# EAGLE design LED (EAGLE 8.0.1)
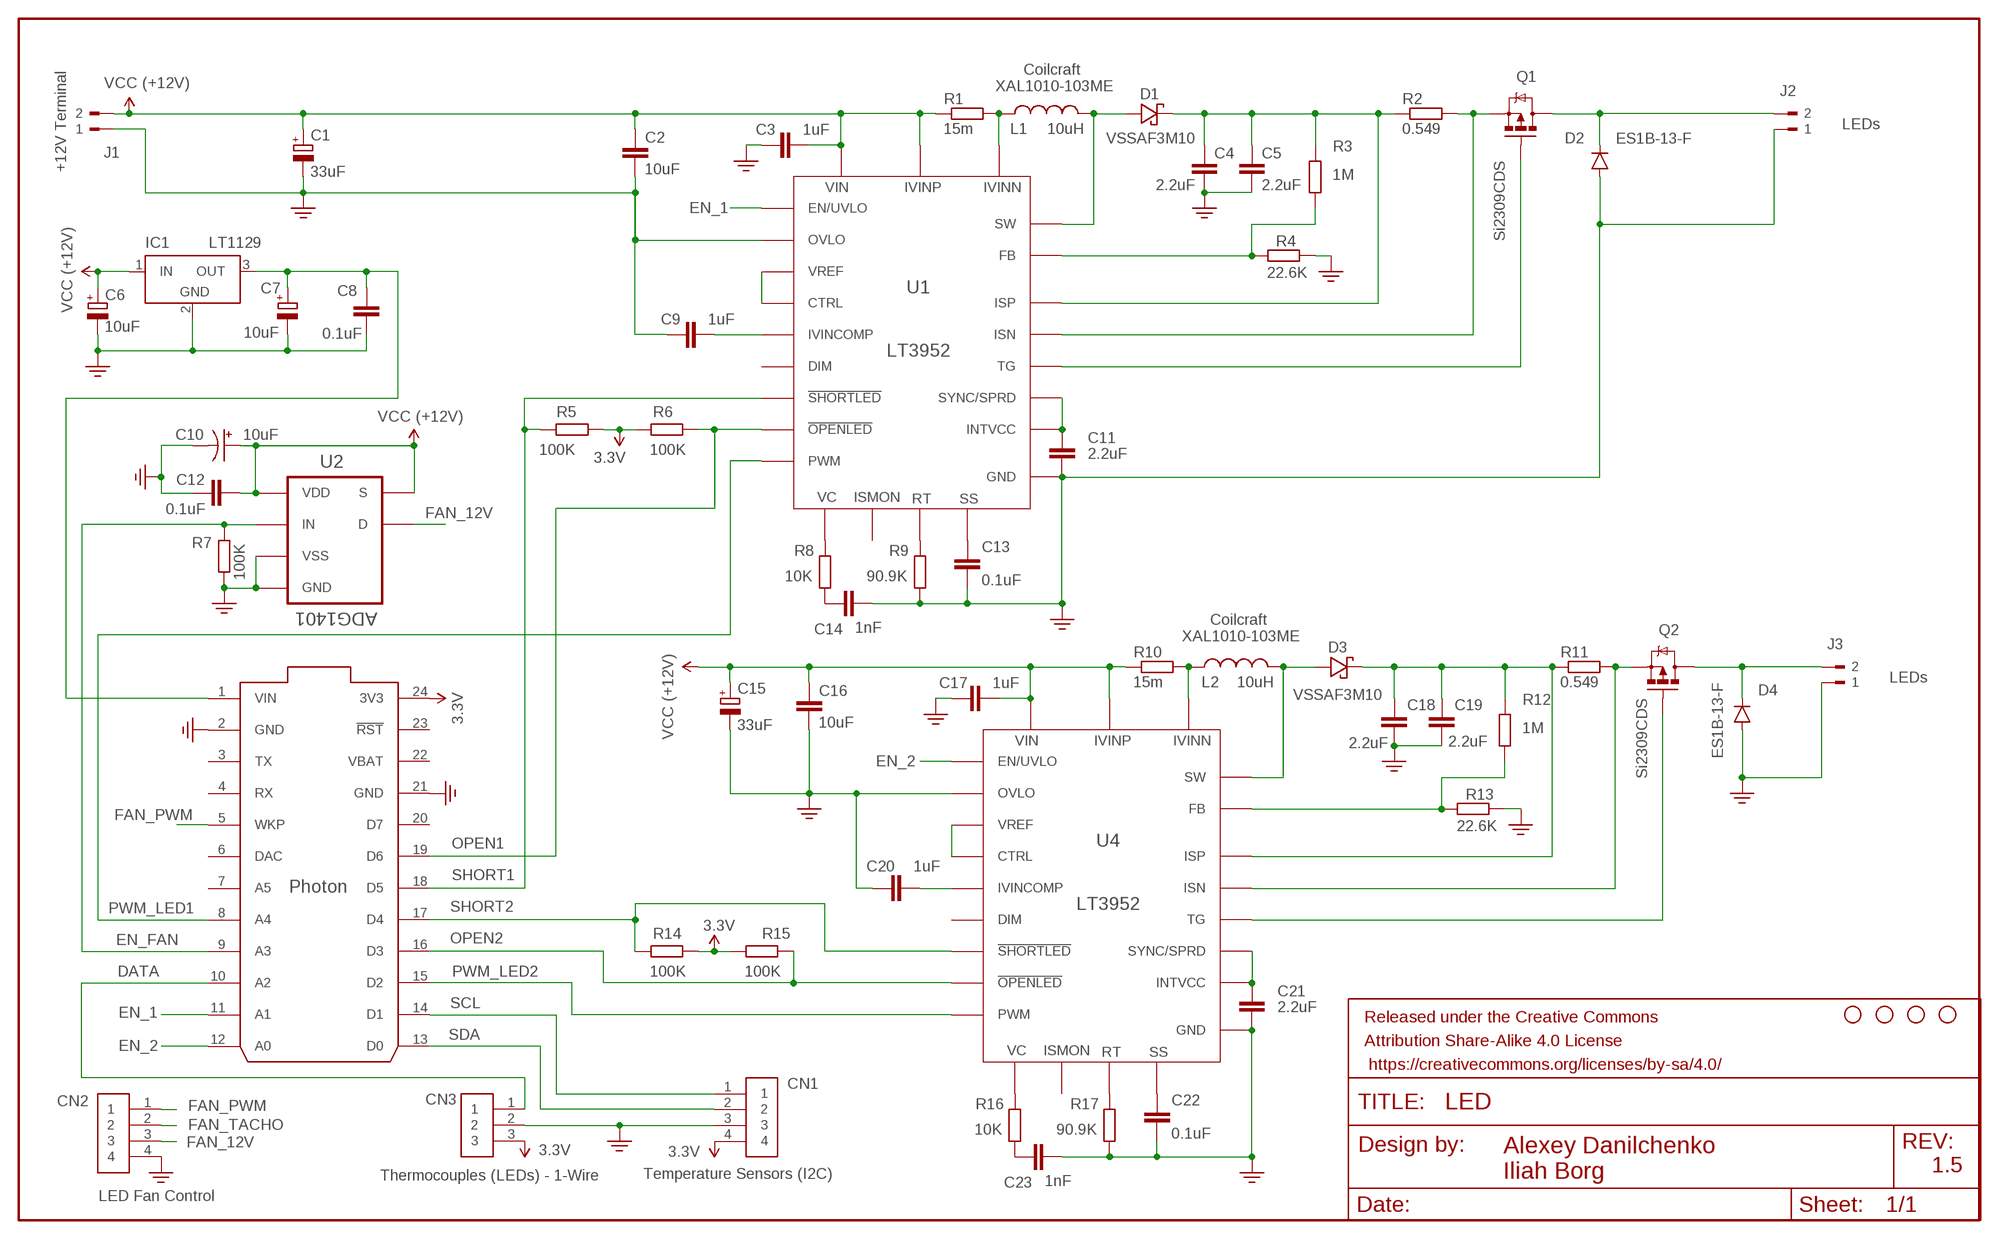
[diagram p0: schematic, sheet 1]

## Parts
C1  33uF  CPOL-EUE  [PANASONIC_E]
C2  10uF  C-EUC1206  [C1206]
C3  1uF  C-EUC0805  [C0805]
C4  2.2uF  C-EUC1206  [C1206]
C5  2.2uF  C-EUC1206  [C1206]
C6  10uF  CPOL-EUCT7343  [CT7343]
C7  10uF  CPOL-EUCT7343  [CT7343]
C8  0.1uF  C-EUC0805  [C0805]
C9  1uF  C-EUC0805  [C0805]
C10  10uF  TANT-CAP1206  [EIA3216]
C11  2.2uF  C-EUC0805  [C0805]
C12  0.1uF  C-EUC0805  [C0805]
C13  0.1uF  C-EUC0805  [C0805]
C14  1nF  C-EUC0805  [C0805]
C15  33uF  CPOL-EUE  [PANASONIC_E]
C16  10uF  C-EUC1206  [C1206]
C17  1uF  C-EUC0805  [C0805]
C18  2.2uF  C-EUC1206  [C1206]
C19  2.2uF  C-EUC1206  [C1206]
C20  1uF  C-EUC0805  [C0805]
C21  2.2uF  C-EUC0805  [C0805]
C22  0.1uF  C-EUC0805  [C0805]
C23  1nF  C-EUC0805  [C0805]
CN1  Temperature Sensors (I2C)  1X4-BIG  [1X04-BIG]
CN2  LED Fan Control  1X4-BIG  [1X04-BIG]
CN3  Thermocouples (LEDs) - 1-Wire  1X03  [1X03]
D1  VSSAF3M10  VSSAF3M10-M3_H  [SODFL5226X100N]
D2  ES1B-13-F  DIODESMA-ALT  [SMA-DIODE_ALT]
D3  VSSAF3M10  VSSAF3M10-M3_H  [SODFL5226X100N]
D4  ES1B-13-F  DIODESMA-ALT  [SMA-DIODE_ALT]
FRAME1  1.0  FRAME-LEDGER  [CREATIVE_COMMONS]
IC1  LT1129  LT1129CST5  [SOT223]
J1  +12V Terminal  PM5.08/2/90BLK  [WEIDMULLER_PM5.08_2]
J2  LEDs  PM5.08/2/90BLK  [WEIDMULLER_PM5.08_2]
J3  LEDs  PM5.08/2/90BLK  [WEIDMULLER_PM5.08_2]
L1  10uH  XAL1010  [XAL1010]
L2  10uH  XAL1010  [XAL1010]
Q1  Si2309CDS  MOSFET-PCHANNEL  [SOT23-3]
Q2  Si2309CDS  MOSFET-PCHANNEL  [SOT23-3]
R1  15m  R-EU_R1206  [R1206]
R2  0.549  R-EU_R1206  [R1206]
R3  1M  R-EU_R0805  [R0805]
R4  22.6K  R-EU_R0805  [R0805]
R5  100K  R-EU_R0805  [R0805]
R6  100K  R-EU_R0805  [R0805]
R7  100K  R-EU_R0805  [R0805]
R8  10K  R-EU_R0805  [R0805]
R9  90.9K  R-EU_R0805  [R0805]
R10  15m  R-EU_R1206  [R1206]
R11  0.549  R-EU_R1206  [R1206]
R12  1M  R-EU_R0805  [R0805]
R13  22.6K  R-EU_R0805  [R0805]
R14  100K  R-EU_R0805  [R0805]
R15  100K  R-EU_R0805  [R0805]
R16  10K  R-EU_R0805  [R0805]
R17  90.9K  R-EU_R0805  [R0805]
STANDOFF1  STAND-OFF  [STAND-OFF]
STANDOFF2  STAND-OFF  [STAND-OFF]
STANDOFF3  STAND-OFF  [STAND-OFF]
STANDOFF4  STAND-OFF  [STAND-OFF]
U1  LT3952  LT3952EFEPBFTSSOP-28_FE/EB-M  [TSSOP-28_FE/EB-M]
U2  ADG1401  ADG1401BRMZ  [SOP65P490X110-8N]
U3  PHOTON_WITH_HEADERS  [PHOTON]
U4  LT3952  LT3952EFEPBFTSSOP-28_FE/EB-M  [TSSOP-28_FE/EB-M]

## Nets
3.3V: CN1.4 CN3.3 R5.1 R6.2 R14.2 R15.1 U3.24(3V3)
+5VDC: C7.+ C8.1 IC1.3(OUT) U3.1(VIN)
DATA: CN3.1 U3.10(A2)
EN_1: U1.8(EN/UVLO) U3.11(A1)
EN_2: U3.12(A0) U4.8(EN/UVLO)
EN_FAN: R7.2 U2.6(IN) U3.9(A3)
FAN_12V: CN2.3 U2.8(D)
FAN_PWM: CN2.1 U3.5(WKP)
FAN_TACHO: CN2.2
GND: C1.- C2.2 C3.2 C4.2 C5.2 C6.- C7.- C8.2 C9.2 C10.C(-) C11.2 C12.1 C13.2 C14.2 C15.- C16.2 C17.2 C18.2 C19.2 C20.2 C21.2 C22.2 C23.2 CN1.3 CN2.4 CN3.2 D2.A D4.A IC1.2(GND) J1.1 J2.1 J3.1 R4.1 R7.1 R9.1 R13.1 R17.1 U1.1(GND) U1.9(OVLO) U1.12(GND) U1.28(GND) U1.EPAD(GND) U2.3(GND) U2.7(VSS) U3.2(GND) U3.21(GND) U4.1(GND) U4.9(OVLO) U4.12(GND) U4.28(GND) U4.EPAD(GND)
N$1: L1.1 R1.2 U1.5(IVINN)
N$2: D1.2(A) L1.2 U1.2(SW) U1.3(SW) U1.4(SW)
N$3: C4.1 C5.1 D1.1(K) R2.1 R3.2 U1.27(ISP)
N$4: R3.1 R4.2 U1.16(FB)
N$5: D2.C J2.2 Q1.3(D)
N$6: Q1.2(S) R2.2 U1.26(ISN)
N$7: Q1.1(G) U1.25(TG)
N$9: C11.1 U1.10(INTVCC) U1.11(SYNC/SPRD)
N$12: U1.17(CTRL) U1.18(VREF)
N$13: C9.1 U1.23(IVINCOMP)
N$14: R9.2 U1.14(RT)
N$15: C13.1 U1.19(SS)
N$16: C14.1 R8.1
N$17: R8.2 U1.13(VC)
N$22: L2.1 R10.2 U4.5(IVINN)
N$23: D3.2(A) L2.2 U4.2(SW) U4.3(SW) U4.4(SW)
N$24: C18.1 C19.1 D3.1(K) R11.1 R12.2 U4.27(ISP)
N$25: D4.C J3.2 Q2.3(D)
N$26: Q2.2(S) R11.2 U4.26(ISN)
N$27: R12.1 R13.2 U4.16(FB)
N$28: Q2.1(G) U4.25(TG)
N$30: C21.1 U4.10(INTVCC) U4.11(SYNC/SPRD)
N$33: U4.17(CTRL) U4.18(VREF)
N$34: C20.1 U4.23(IVINCOMP)
N$35: C22.1 U4.19(SS)
N$36: R17.2 U4.14(RT)
N$37: C23.1 R16.1
N$38: R16.2 U4.13(VC)
OPEN1: R6.1 U1.22(!OPENLED) U3.19(D6)
OPEN2: R15.2 U3.16(D3) U4.22(!OPENLED)
PWM_LED1: U1.20(PWM) U3.8(A4)
PWM_LED2: U3.15(D2) U4.20(PWM)
SCL: CN1.1 U3.14(D1)
SDA: CN1.2 U3.13(D0)
SHORT1: R5.2 U1.21(!SHORTLED) U3.18(D5)
SHORT2: R14.1 U3.17(D4) U4.21(!SHORTLED)
VDD: C1.+ C2.1 C3.1 C6.+ C10.A(+) C12.2 C15.+ C16.1 C17.1 IC1.1(IN) J1.2 R1.1 R10.1 U1.6(IVINP) U1.7(VIN) U2.1(S) U2.4(VDD) U4.6(IVINP) U4.7(VIN) ; supply symbol labelled VCC (+12V)
Unconnected: U1.15(DIM) U1.24(ISMON) U3.3(TX) U3.4(RX) U3.6(DAC) U3.7(A5) U3.20(D7) U3.23(!RST) U4.15(DIM) U4.24(ISMON)

## Notes on the sheet
- Coilcraft 
  XAL1010-103ME
- Coilcraft 
  XAL1010-103ME
- 1.5

## Power pins joined to a net without a drawn wire
GND: IC1.4(GND)
VBAT: U3.22(VBAT)

## Library data of the parts
C1 C15 = resistor:CPOL-EU: POLARIZED CAPACITOR, European symbol
C2 C4 C5 C8 C16 C18 C19 = Spectron2:C-EU: CAPACITOR, European symbol
C3 C9 C11 C13 C14 C17 C20-C23 = rcl:C-EU: CAPACITOR, European symbol
C6 C7 = Spectron:CPOL-EU: POLARIZED CAPACITOR, European symbol
C10 = Spectron2:TANT-CAP: Tantalum SMT
C12 = resistor:C-EU: CAPACITOR, European symbol
CN1 CN2 = adafruit:1X4: 4-pin connector
CN3 = arducorder-mini:1X03
D1 D3 = VSSAF3M10-M3_H:VSSAF3M10-M3_H: Schottky Diodes & Rectifiers TMBS 100V Vrrm eSMP SlimSMA (DO-221AC) Source: Datasheet <https://www.vishay.com/docs/87507/vssaf3m10.pdf>; ARROW_PART_NUMBER: VSSAF3M10-M3/H; ARROW_PRICE/STOCK: https://www.arrow.com/en/products/vssaf3m10-m3h/vishay; DESCRIPTION: Schottky Diodes & Rectifiers TMBS 100V Vrrm eSMP SlimSMA (DO-221AC); HEIGHT: 1mm; MANUFACTURER_NAME: Vishay; MANUFACTURER_PART_NUMBER: VSSAF3M10-M3/H
D2 D4 = SparkFun-DiscreteSemi:DIODE: Diode These are standard reverse protection diodes and small signal diodes. SMA package can handle up to about 1A. SOD-323 can handle about 200mA. What the SOD-323 package when ordering, there are some mfgs out there that are 5-pin packages.
FRAME1 = Spectron2:FRAME-LEDGER: Schematic Frame Standard 11x14 US Ledger frame
IC1 = linear-technology-3:LT1129CST5: VOLTAGE REGULATOR with shutdown
J1-J3 = WEIDMULLER-PM5.08_2_90BLK:PM5.08/2/90BLK: TERMINAL BLOCK, SIDE ENTRY, 2WAY; MPN: PM5.08/2/90 BLK; OC_FARNELL: 1131855; OC_NEWARK: 26M1980; PACKAGE: TH-R/A; SUPPLIER: WEIDMULLER
L1 L2 = LED:XAL1010
Q1 Q2 = SparkFun-DiscreteSemi:MOSFET-PCHANNEL: Generic PMOSFET IRLML2244 - TRANS-11153 (SOT-23 -20V -4.3A) (1.Gate 2.Source 3.Drain) FQP27P06 - COM-10349 <http://www.sparkfun.com/products/10349> (TO-220 -60V -27A) (1.Gate 2.Source 3.Drain); PROD_ID: TRANS-08285
R1-R6 R8-R17 = Spectron2:R-EU_: RESISTOR, European symbol
R7 = rcl:R-EU_: RESISTOR, European symbol
STANDOFF1-STANDOFF4 = Spectron2:STAND-OFF: #4 Stand Off This is the mechanical footprint for a #4 phillips button head screw. Use the keepout ring to avoid running the screw head into surrounding components. SKU : PRT-00447
U1 U4 = LT3952:LT3952EFEPBF; MANUFACTURER_PART_NUMBER: LT3952EFE#PBF; VENDOR: Linear Technology
U2 = Analog Devices_By_element14_Batch_1:ADG1401BRMZ: SPST Switches; MPN: ADG1401BRMZ; OC_FARNELL: 1786219; OC_NEWARK: 52R8027; PACKAGE: MSOP-8; SUPPLIER: Analog Devices
U3 = Spectron2:PHOTON

## Board
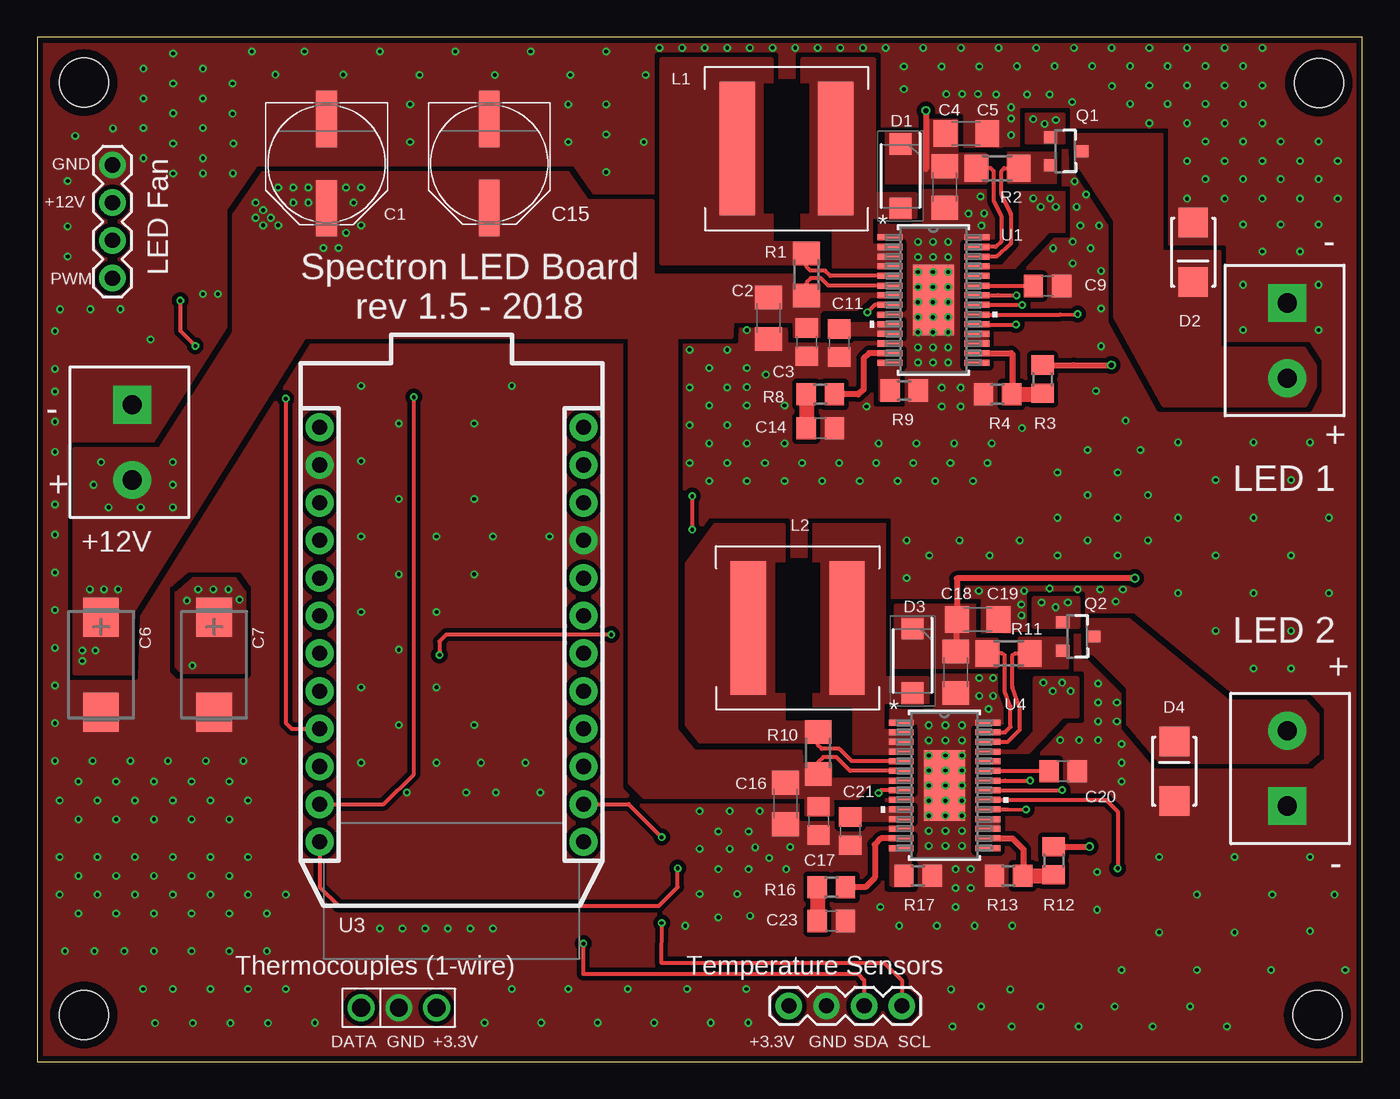
[diagram p1: board, top side]
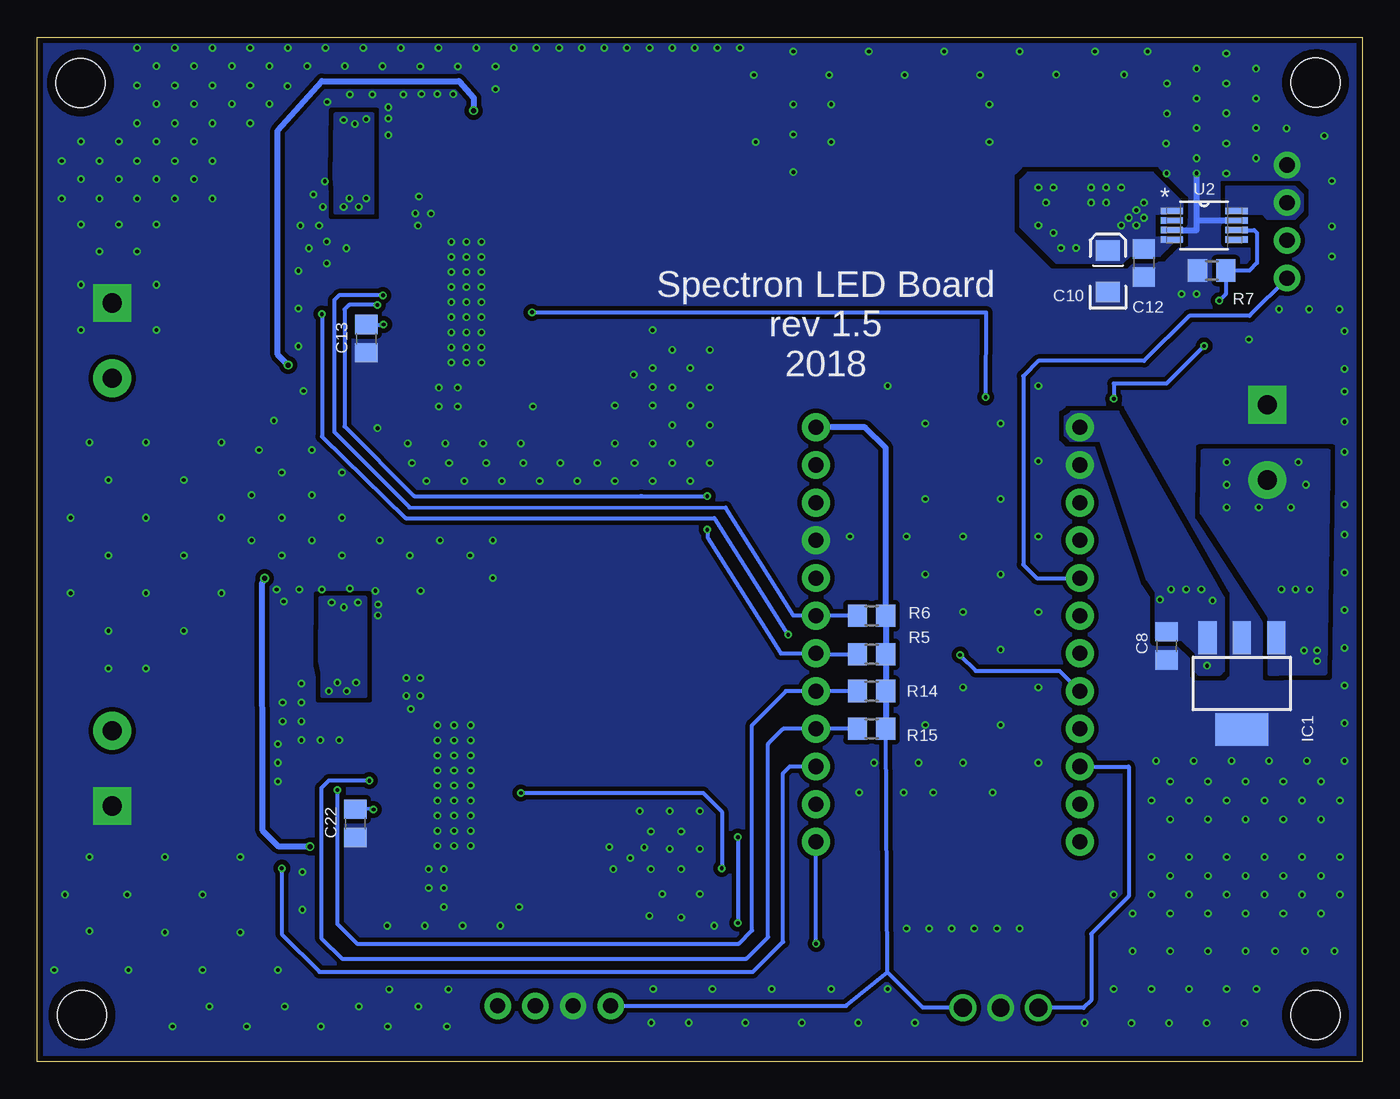
[diagram p2: board, bottom side, seen from below]

Size 89.34 x 69.04 mm. Coordinates in mm from the lower left corner, seen from the top.
Outline: 0,0 89.34,0 89.34,69.04 0,69.04 0,0
Copper layers (1*16): Top 0.035559375mm / dielectric 1.6mm / Bottom 0.035559375mm
Design rules "oshpark-2layer *": minimum track width 10mil, minimum drill 10mil, track to track 0.18288125mm, track to pad 6mil, pad to pad 6mil, via to via 6mil, smd to smd 6mil, copper to edge 15mil, drill to drill 6mil, minimum pad ring 5mil, minimum via ring 5mil, stop-mask expansion 2.5mil, vias tented up to drill 0mil, thermal gap 10mil
tRestrict: area 64.5,60.7 to 65,61.1; area 65.2,28 to 65.7,28.4

### Footprints (pad centres in the part's own frame; a part is rotated, then mirrored left to right if it is on the bottom)
PANASONIC_E = smd 3.8 x 1.4: + 3,0; - -3,0
C1206 = smd 1.6 x 1.8: 1 -1.4,0; 2 1.4,0
C0805 = smd 1.3 x 1.5: 1 -0.95,0; 2 0.95,0
CT7343 = smd 2.6 x 2.4: + -3.2,0; - 3.2,0
EIA3216 = smd 1.4 x 1.6: A 1.4,0; C -1.4,0
1X04-BIG = drill 1.016 pad 1.778: 1 0,0; 2 2.54,0; 3 5.08,0; 4 7.62,0
1X03 = drill 1.2: 1 -2.54,0; 2 0,0; 3 2.54,0
SODFL5226X100N = smd 1.45 x 1.49: 1 -2.175,0; 2 2.175,0
SMA-DIODE_ALT = smd 2 x 2: A -2,0; C 2,0
SOT223 = smd 1.219 x 2.235: 1 -2.311,-3.099; 2 0,-3.099; 3 2.311,-3.099 | smd 3.6 x 2.2: 4 0,3.099
WEIDMULLER_PM5.08_2 = drill 1.3 pad 2.54 square: 1 -2.54,0 | drill 1.3 pad 2.54: 2 2.54,0
XAL1010 = smd 2.38 x 9: 1 -3.325,0; 2 3.325,0
SOT23-3 = smd 0.8 x 0.9: 1 -0.95,-1; 2 0.95,-1; 3 0,1.1
R1206 = smd 1.6 x 1.803: 1 -1.422,0; 2 1.422,0
R0805 = smd 1.3 x 1.5: 1 -0.95,0; 2 0.95,0
STAND-OFF = hole 3.302: 0,0
TSSOP-28_FE/EB-M = smd 1.666 x 0.406: 1 -2.926,4.227; 2 -2.926,3.576; 3 -2.926,2.926; 4 -2.926,2.276; 5 -2.926,1.626; 6 -2.926,0.975; 7 -2.926,0.325; 8 -2.926,-0.325; 9 -2.926,-0.975; 10 -2.926,-1.626; 11 -2.926,-2.276; 12 -2.926,-2.926; 13 -2.926,-3.576; 14 -2.926,-4.227; 15 2.926,-4.227; 16 2.926,-3.576; 17 2.926,-2.926; 18 2.926,-2.276; 19 2.926,-1.626; 20 2.926,-0.975; 21 2.926,-0.325; 22 2.926,0.325; 23 2.926,0.975; 24 2.926,1.626; 25 2.926,2.276; 26 2.926,2.926; 27 2.926,3.576; 28 2.926,4.227 | smd 2.743 x 4.75: EPAD 0,0
SOP65P490X110-8N = smd 1.499 x 0.432: 1 -2.184,0.965; 2 -2.184,0.33; 3 -2.184,-0.33; 4 -2.184,-0.965; 5 2.184,-0.965; 6 2.184,-0.33; 7 2.184,0.33; 8 2.184,0.965
PHOTON = drill 1.016 pad 1.88: 1 1.27,32.258; 2 1.27,29.718; 3 1.27,27.178; 4 1.27,24.638; 5 1.27,22.098; 6 1.27,19.558; 7 1.27,17.018; 8 1.27,14.478; 9 1.27,11.938; 10 1.27,9.398; 11 1.27,6.858; 12 1.27,4.318; 13 19.05,4.318; 14 19.05,6.858; 15 19.05,9.398; 16 19.05,11.938; 17 19.05,14.478; 18 19.05,17.018; 19 19.05,19.558; 20 19.05,22.098; 21 19.05,24.638; 22 19.05,27.178; 23 19.05,29.718; 24 19.05,32.258

### Placement (x,y rotation side)
C1  19.51,60.51 270 top
C2  49.31,50.1 270 top
C3  51.88,48.49 270 top
C4  61.18,58.94 270 top
C5  62.64,62.55 0 top
C6  4.32,26.75 270 top
C7  11.94,26.75 270 top
C8  13.21,28.02 270 bottom
C9  68.12,52.27 0 top
C10  17.15,53.26 90 bottom
C11  54.07,48.42 270 top
C12  14.73,53.82 90 bottom
C13  67.15,48.72 270 bottom
C14  52.8,42.68 0 top
C15  30.48,60.53 270 top
C16  50.44,17.4 270 top
C17  52.68,16.23 270 top
C18  61.93,26.24 270 top
C19  63.4,29.8 0 top
C20  69.17,19.57 0 top
C21  54.82,15.53 270 top
C22  67.89,16.06 270 bottom
C23  53.55,9.47 0 top
CN1  58.29,3.76 180 top
CN2  5.08,52.8 90 top
CN3  24.38,3.63 0 top
D1  58.2,59.67 270 top
D2  77.93,54.54 270 top
D3  59.01,27 270 top
D4  76.66,19.57 90 top
FRAME1  66.77,44.97 90 top
IC1  8.13,25.48 180 bottom
J1  6.41,41.73 270 top
J2  84.28,48.59 270 top
J3  84.28,19.76 90 top
L1  50.51,61.53 0 top
L2  51.27,29.24 0 top
Q1  69.31,61.35 270 top
Q2  70.12,28.65 270 top
R1  51.87,53.04 90 top
R2  64.74,60.21 0 top
R3  67.79,45.99 90 top
R4  64.74,44.97 0 top
R5  33.08,27.46 180 bottom
R6  33.08,30.05 0 bottom
R7  10.16,53.31 0 bottom
R8  52.8,44.97 0 top
R9  58.45,45.22 180 top
R10  52.65,20.8 90 top
R11  65.48,27.51 0 top
R12  68.53,13.54 90 top
R13  65.48,12.52 0 top
R14  33.08,24.97 0 bottom
R15  33.08,22.43 180 bottom
R16  53.55,11.76 0 top
R17  59.39,12.52 180 top
STANDOFF1  86.4,65.95 0 top
STANDOFF2  3.15,65.97 0 top
STANDOFF3  86.31,3.15 0 top
STANDOFF4  3.15,3.15 0 top
U1  60.42,51.32 0 top
U2  10.67,56.36 0 bottom
U3  17.78,10.49 0 top
U4  61.17,18.62 0 top

### Tracks (layer width: path | path; a pad name or v marks a point on that pad's centre or on a via)
3.3V
  Bottom 0.254: CN1.4 34.8,3.76 32.03,6.03 | 32.03,6.03 R15.1 | CN3.3 29.64,3.63 32.03,6.03
  Bottom 0.406: U3.24 33.53,42.75 32.13,41.35 R6.2 R5.1 R14.2 R15.1
+5VDC  (via drill 0.25 pad 0.15)
  other vias: 10.1,31.06 13.65,31.13 10.86,31.83 11.87,31.83 10.48,26.68 12.89,31.83
  pour Top (no thermals): 9.4,26.62 9.4,31.57 10.54,32.52 13.34,32.52 13.97,31.64 13.97,26.36 13.84,26.24 9.78,26.24
  pour Bottom (no thermals): 13.84,28.52 13.84,31.64 14.48,32.52 17.59,41.86 19.62,41.86 20,42.24 20,43.45 19.56,43.76 16.51,43.76 9.4,31.25 9.4,26.36 9.65,26.11 10.99,26.11 11.18,26.3 11.18,27.51 12.13,28.46 13.78,28.46
DATA
  Bottom 0.254: U3.10 15.75,19.89 15.75,11.15 18.29,8.61 18.29,4.13 18.8,3.63 CN3.1
EN_1  (via drill 0.25 pad 0.15)
  Top 0.254: U1.8 56.48,50.99 v55.98,50.49 | U3.11 23.37,17.35 25.4,19.38 v25.4,44.78
  Bottom 0.254: v55.98,50.49 25.38,50.49 v25.4,44.78
EN_2  (via drill 0.25 pad 0.15)
  Top 0.254: U4.8 56.9,18.29 v56.72,18.11 | v43.18,13.03 43.18,11.76 41.91,10.49 20.32,10.49 19.05,11.76 U3.12
  Bottom 0.254: v56.72,18.11 44.45,18.11 43.18,16.84 v43.18,13.03
EN_FAN  (via drill 0.25)
  Top 0.254: v9.65,51.28 9.65,49.25 v10.67,48.23 | v16.76,44.67 16.76,22.83 17.17,22.43 U3.9
  Bottom 0.254: U2.6 7.29,56.03 7.11,55.85 7.11,53.82 7.62,53.31 R7.2 9.21,51.72 v9.65,51.28 | v10.67,48.23 13.21,45.69 16.76,45.69 v16.76,44.67
FAN_12V
  pour Bottom (no thermals): 4.06,58.39 4.57,58.9 9.14,58.9 9.14,57.37 9.14,57.22 6.7,57.22 6.4,56.87 4.57,56.87 4.06,57.37
  pour Bottom (no thermals): 4.06,58.39 4.57,58.9 9.09,58.9 9.09,57.37 9.14,57.27 6.7,57.27 6.4,56.87 4.57,56.87 4.06,57.37
FAN_PWM
  Bottom 0.254: CN2.1 7.62,50.26 11.68,50.26 14.73,47.21 21.84,47.21 22.86,46.2 22.86,33.5 21.95,32.59 U3.5
GND  (via drill 0.25 pad 0.15)
  Bottom 0.406: 11.18,56.69 U2.7 | 11.18,56.69 v11.18,59.86 | U2.3 11.18,56.03 11.18,56.69
  other vias: 62.78,57.14 63.59,58.3 63.85,57.16 65.67,63.55 63.66,56.34 69.94,59.32 70.71,58.43 69.82,55.26 70.07,57.61 70.33,56.34 71.6,56.34 68.48,54.81 71.02,54.81 69.82,53.8 71.72,53.29 71.72,50.75 71.72,48.21 60.99,45.41 62.26,45.41 60.99,44.14 62.26,44.14 55.91,44.14 47.85,49.29 47.85,46.75 47.85,45.45 49.13,46.29 47.85,44.21 50.39,44.21 50.39,41.67 47.85,41.67 47.85,39.13 50.39,39.13 52.93,39.13 55.47,39.13 58.01,39.13 60.55,39.13 56.74,41.67 59.28,41.67 61.82,41.67 64.36,41.67 63.09,39.13 66.39,42.68 66.54,31.73 63.52,25.86 64.44,24.65 63.52,24.65 64.15,23.76 60.11,22.67 61.23,22.67 62.35,22.67 64.44,25.86 61.93,12.97 62.94,12.97 61.93,11.7 62.94,11.7 56.85,10.43 58.12,9.16 60.66,9.16 61.93,10.43 63.2,9.16 65.74,9.16 47.96,15.51 47.96,12.97 50.5,12.97 50.76,14.47 49.35,13.73 48.06,9.83 43.69,9.16 71.45,12.78 71.45,10.24 73.1,21.41 73.1,20.14 73.1,18.87 72.79,24.21 71.52,25.48 71.52,24.21 71.52,22.94 68.98,21.67 70.25,21.67 71.52,21.67 72.79,22.94 7.87,7.44 10.41,7.44 12.95,7.44 15.49,7.44 14.22,4.9 9.14,4.9 16.76,4.9 32,4.9 35.81,4.9 21.84,20.14 24.38,22.68 21.84,25.22 24.38,27.76 21.84,30.3 24.38,32.84 21.84,35.38 24.38,37.92 21.84,40.46 24.38,43 21.84,45.54 29.46,43 32,45.54 29.46,37.92 29.46,32.84 26.92,35.38 30.73,35.38 34.54,35.38 26.92,30.3 26.92,25.22 26.92,20.14 29.46,22.68 20.64,66.5 30.86,66.48 38.35,62.48 38.35,64.51 35.94,66.48 41.02,66.48 40.89,61.97 35.81,61.97 38.35,59.94 25.15,64.51 72.45,65.73 85.8,41.73 81.99,41.73 76.91,41.73 79.45,39.19 84.53,39.19 73.37,43.19 76.91,36.65 81.99,36.65 87.07,36.65 79.45,34.11 84.53,34.11 87.07,31.57 81.99,31.57 76.91,31.57 79.45,29.03 84.53,29.03 81.99,26.49 84.53,26.49 75.64,13.79 80.72,13.79 78.18,11.25 75.64,8.71 80.72,8.71 83.26,11.25 87.45,11.25 85.8,13.79 78.18,6.17 73.1,6.17 2.79,18.87 5.33,18.87 7.87,18.87 10.41,18.87 12.95,18.87 14.22,17.6 11.68,17.6 9.14,17.6 6.6,17.6 4.06,17.6 1.52,17.6 2.79,16.33 5.33,16.33 7.87,16.33 10.41,16.33 12.95,16.33 1.21,41.1 1.21,37.54 1.21,35.51 1.21,32.97 1.52,13.79 4.06,13.79 6.6,13.79 9.14,13.79 11.68,13.79 14.22,13.79 14.22,11.25 11.68,11.25 9.14,11.25 6.6,11.25 4.06,11.25 1.52,11.25 2.79,12.52 5.33,12.52 7.87,12.52 10.41,12.52 12.95,12.52 66.35,30.81 35.81,64.51 25.78,66.48 25.15,61.97 71.37,45.19 72.64,3.71 77.72,3.71 83.18,6.17 85.8,8.79 67.64,3.71 63.64,3.71 65.6,4.87 61.6,4.87 65.7,2.37 61.7,2.37 70.2,2.37 75.2,2.37 80.2,2.37 29.92,20.14 28.92,18.14 30.92,18.14 24.92,18.14 33.92,18.14 32.92,20.14 39.81,4.9 43.81,4.9 47.81,4.9 2.79,9.98 5.33,9.98 7.87,9.98 10.41,9.98 12.95,9.98 15.49,9.98 16.76,11.25 7.95,2.59 10.49,2.59 13.03,2.59 15.57,2.59 18.73,2.62 30.16,2.62 33.97,2.62 37.78,2.62 41.59,2.62 45.4,2.62 47.94,2.62 1.21,30.43 1.21,27.89 1.21,25.35 1.21,22.81 1.21,20.27 3.75,20.27 6.29,20.27 8.83,20.27 11.37,20.27 13.91,20.27 65.67,62.43 60.97,67.05 63.51,67.06 66.05,67.07 68.59,67.08 5.87,7.44 3.87,7.44 1.87,7.44 7.14,4.9 88.18,6.17 59.38,55.24 60.39,55.24 61.41,55.24 59.38,54.23 60.39,54.23 61.41,54.23 61.41,53.21 60.39,53.21 59.38,53.21 59.38,52.2 60.39,52.2 61.41,52.2 61.41,51.18 60.39,51.18 59.38,51.18 59.38,50.16 60.39,50.16 61.41,50.16 61.41,49.15 60.39,49.15 59.38,49.15 61.41,48.13 61.41,47.12 60.39,47.12 60.39,48.13 59.38,48.13 59.38,47.12 60.11,21.65 62.35,21.65 60.11,20.64 60.11,19.62 60.11,18.61 60.11,17.59 60.11,16.57 60.11,15.56 60.11,14.54 62.35,20.64 62.35,19.62 62.35,18.61 62.35,17.59 62.35,16.57 62.35,15.56 62.35,14.54 61.23,21.65 61.23,20.64 61.23,19.62 61.23,18.61 61.23,17.59 61.23,16.57 61.23,15.56 61.23,14.54 48.72,16.88 48.42,14.44 49.07,40.35 51.57,40.35 54.07,40.35 56.57,40.35 59.07,40.35 61.57,40.35 64.07,40.35 65.67,64.31 64.65,65.17 66.73,65.17 63.43,65.2 62.36,65.2 61.3,65.19 66.36,30.08 72.71,31.01 7.18,62.91 7.18,64.91 7.18,66.91 9.18,65.91 11.18,66.91 11.18,64.91 11.18,62.91 9.18,63.91 13.18,65.91 58.43,67.05 48.05,68.31 73.19,31.82 71.67,31.82 70.14,31.82 68.25,31.89 68.26,65.17 69.78,64.66 46.53,68.31 45.01,68.31 43.48,68.31 41.96,68.31 49.58,68.31 51.1,68.31 52.63,68.31 54.15,68.31 55.67,68.31 57.2,68.31 38.35,68.07 33.27,68.07 28.19,68.07 23.11,68.07 18.03,68.07 14.48,68.07 16.07,66.5 58.43,65.53 59.74,68.31 62.28,68.31 64.82,68.31 67.36,68.31 69.9,68.31 72.44,68.31 74.98,68.31 77.52,68.31 80.06,68.31 82.6,68.31 71.13,67.08 73.67,67.08 76.21,67.08 78.75,67.08 81.29,67.08 74.98,65.77 77.52,65.77 80.06,65.77 82.6,65.77 82.6,63.23 81.29,64.54 78.75,64.54 76.21,64.54 73.67,64.54 74.98,63.23 77.52,63.23 80.06,63.23 81.29,62 63.49,31.73 72.85,36.65 68.79,36.65 70.82,35.13 74.88,35.13 66.25,35.13 62.18,35.13 58.63,35.13 72.85,34.11 68.79,34.11 64.21,34.11 60.15,34.11 58.63,32.59 72.85,39.7 70.82,38.18 68.79,39.7 70.82,41.22 74.37,41.22 74.88,38.18 46.53,40.35 43.99,40.35 45.31,39.13 45.31,41.67 46.53,42.89 45.31,44.21 46.53,45.43 43.99,42.89 43.99,45.43 43.99,47.97 45.31,46.75 46.53,47.97 83.83,62 86.37,62 85.14,60.69 82.6,60.69 87.68,60.69 86.37,59.46 83.83,59.46 85.14,58.15 87.68,58.15 78.75,62 80.06,60.69 77.52,60.69 78.75,59.46 81.29,59.46 82.6,58.15 80.06,58.15 77.52,58.15 81.29,56.42 83.83,56.42 86.37,56.42 82.6,54.6 85.14,54.6 81.29,52.35 81.29,49.3 86.37,52.35 86.37,49.3 46.69,16.88 44.66,16.88 45.93,15.51 44.66,14.34 46.69,14.34 44.66,11.29 47.2,11.29 45.93,12.97 45.93,9.73 13.18,63.88 13.24,61.88 9.18,61.88 11.18,60.88 9.18,67.94 2.57,62.38 5.11,62.89 2.06,59.34 2.06,56.29 2.06,54.26 1.56,50.7 3.59,50.7 5.62,50.7 7.65,48.67 1.21,43.13 1.21,45.16 1.21,46.69 1.21,49.23 11.68,4.9 23.11,8.97 24.64,8.97 26.16,8.97 27.69,8.97 29.21,8.97 30.73,8.97 12.19,51.73 11.18,51.73 13.21,59.86 9.18,59.84 7.18,60.88
  pour Bottom (isolate 0.305, rank 6, no thermals): 0,69.08 0,0 89.36,0 89.36,69.08
  pour Top (isolate 0.305, rank 6, no thermals): 0,0 89.36,0 89.36,69.1 0,69.1
N$1
  Top 0.254: U1.5 53.47,52.95 53.12,53.3 52.12,53.3 51.87,53.55 R1.2
  pour Top (no thermals): 52.6,53.77 42.1,53.77 42.1,67.57 49.5,67.57 49.5,55.17 52.6,55.17
N$2
  pour Top (no thermals): 51.6,67.57 56.4,67.57 56.4,58.47 59.2,58.47 59.21,56.91 56.21,56.91 56.21,55 58.12,55 58.1,53.57 53.7,53.57 53.7,56.17 51.6,56.17
N$3  (via drill 0.33 pad 0.15)
  Top 0.254: 63.15,60.21 R2.1 64.28,60.21 64.48,60.01 64.48,58 64.99,56.97 64.99,55.26 64.63,54.9 U1.27
  Top 0.406: R3.2 69.88,46.94 v72.42,46.94 | v59.91,64.08 59.91,60.15
  Bottom 0.406: v72.42,46.94 73.12,47.64 73.12,62.75 70.15,66.08 60.91,66.08 59.91,64.94 v59.91,64.08
  pour Top (no thermals): 57.24,59.26 63.95,59.26 63.95,61.11 62,61.11 62,63.41 60.06,63.41 60.06,62.49 57.24,62.49
N$4
  Top 0.406: U1.16 65.65,47.74 65.75,47.64 65.75,45.04 R4.2
  Top 1.016: R4.2 67.72,44.97 R3.1
N$5
  pour Top (no thermals): 70,62.47 75.8,62.47 75.8,54.57 79.7,54.57 79.7,48.07 85.4,48.07 86.12,46.94 86.12,45.48 85.49,44.21 75.96,44.21 72.68,50.18 72.68,56.65 70.33,60.27 70.01,60.27
N$6
  Top 0.254: U1.26 64.68,54.25 65.63,55.13 65.63,57.1 65,58.43 65,60.01 65.21,60.21 R2.2
  pour Top (no thermals): 68.61,61.23 68.61,59.26 65.54,59.26 65.54,61.23
N$7  (via drill 0.25 pad 0.15)
  other vias: 67.15,63.51 68.67,63.45 67.91,63.19 67.15,58.18 68.29,58.18 67.66,57.61 68.67,57.61
  pour Top (no thermals): 66.71,63.83 69.18,63.83 69.18,61.92 66.71,61.92
  pour Bottom (no thermals): 66.71,63.83 69.25,63.83 69.31,59.57 69.25,58.81 69.25,57.23 66.71,57.23
  pour Top (no thermals): 66.33,58.56 69.18,58.56 69.18,55.96 68.17,55.96 65.88,53.54 63.15,53.54 63.15,53.61 65.12,53.61 66.33,54.94
N$9
  pour Top (no thermals): 53.56,49.73 58.13,49.73 58.13,48.97 53.56,48.97
N$12
  pour Top (no thermals): 62.77,49.1 64.04,49.1 64.04,48.34 62.77,48.34
N$13
  Top 0.254: U1.23 63.37,52.27 C9.1
N$14
  pour Top (no thermals): 56.8,47.13 56.8,44.65 56.86,44.59 58.07,44.59 58.07,47.13
N$15  (via drill 0.25 pad 0.15)
  Top 0.254: U1.19 63.35,49.67 v65.98,49.67
  Bottom 0.254: C13.1 66.07,49.67 v65.98,49.67
N$16
  Top 1.016: R8.1 C14.1
N$17
  Top 0.406: U1.13 56.08,47.74 55.72,47.38 55.72,45.29 55.34,44.97 R8.2
N$22
  Top 0.254: U4.5 54.91,20.24 54.09,21.07 52.9,21.07 52.65,21.32 R10.2
  pour Top (no thermals): 44.7,21.57 43.8,22.67 43.8,33.57 45.7,36.19 50.3,36.19 50.3,22.87 53.4,22.87 53.4,21.57
N$23
  pour Top (no thermals): 52.4,36.19 57.1,36.19 57.1,25.86 60.02,25.86 60.02,24.21 56.98,24.21 56.98,22.3 58.88,22.3 58.88,20.77 55.1,20.77 55.1,23.97 52.4,23.97
N$24  (via drill 0.33 pad 0.15)
  Top 0.254: U4.27 65.25,22.19 65.61,22.55 65.61,23.92 65.23,24.92 65.23,27.39 65.02,27.51 R11.1
  Top 0.406: R12.2 v70.94,14.49 | v74,32.57 62,32.57 62,29.97 C18.1
  Bottom 0.406: v70.94,14.49 73.04,14.49 74.12,15.57 74.15,32.27 v74,32.57
  pour Top (no thermals): 57.86,26.62 64.72,26.62 64.72,28.42 63.2,28.42 63.2,30.75 57.86,30.71
N$25
  pour Top (no thermals): 70.8,29.77 73.6,29.77 80.3,24.27 85.5,24.27 86.31,23.4 86.31,20.78 85.59,20.17 75.71,20.17 73.55,22.75 73.55,25.16 71.2,27.51 70.88,27.51
N$26
  Top 0.254: U4.26 65.43,21.54 66.25,22.36 66.25,23.82 65.75,25.24 65.75,27.39 65.95,27.51 R11.2
  pour Top (no thermals): 69.42,28.52 69.42,26.56 66.25,26.56 66.25,28.52
N$27
  Top 0.406: U4.16 65.76,15.04 66.5,14.3 66.5,12.59 R13.2
  Top 1.016: R13.2 68.47,12.52 R12.1
N$28  (via drill 0.25 pad 0.15)
  other vias: 67.71,30.94 69.48,30.94 68.66,30.62 67.83,25.54 69.1,25.54 68.47,24.97 69.67,24.97
  pour Top (no thermals): 67.2,31.25 70.18,31.25 70.18,29.29 67.2,29.29
  pour Bottom (no thermals): 67.2,31.25 70.25,31.25 70.31,27 70.12,26.24 70.12,24.65 67.2,24.65
  pour Top (no thermals): 67.26,25.86 70.12,25.86 70.12,23.25 69.1,23.25 66.82,20.84 64.09,20.84 64.09,20.9 66.06,20.9 67.26,22.24
N$30
  pour Top (no thermals): 54.24,17.03 58.82,17.03 58.82,16.27 54.24,16.27
N$33
  pour Top (no thermals): 63.45,16.4 64.79,16.4 64.79,15.63 63.45,15.63
N$34
  Top 0.254: U4.23 68.22,19.59 C20.1
N$35  (via drill 0.25 pad 0.15)
  Top 0.254: U4.19 65.42,16.99 v66.66,16.99
  Bottom 0.254: v66.66,16.99 66.69,17.03 C22.1
N$36
  pour Top (no thermals): 57.55,14.43 57.55,11.95 57.67,11.89 58.88,11.89 58.88,14.43
N$37
  Top 1.016: R16.1 C23.1
N$38
  Top 0.406: U4.13 56.89,15.04 56.47,14.62 56.47,12.4 55.83,11.76 R16.2
OPEN1  (via drill 0.25 pad 0.15)
  Top 0.254: U1.22 64.79,51.64 v66.02,51.64
  Bottom 0.254: v66.02,51.64 68.99,51.64 69.31,51.32 69.31,42.43 64.23,37.35 42.93,37.34 38.35,30.05 U3.19 R6.1
OPEN2  (via drill 0.25 pad 0.15)
  Top 0.254: U4.22 65.27,18.94 v66.94,18.93
  Bottom 0.254: v66.94,18.93 69.67,18.93 70.18,18.43 70.18,8.33 68.79,6.93 41.53,6.93 40.07,8.4 40.07,21.41 39.05,22.43 U3.16 R15.2
PWM_LED1  (via drill 0.25, 0.25 pad 0.15)
  Top 0.254: U1.20 68.97,50.34 v70.14,50.37 | v38.71,28.77 27.58,28.77 27.13,28.32 v27.13,27.4
  Bottom 0.254: v70.14,50.37 70.14,42.11 64.48,36.63 43.69,36.63 38.73,28.77 v38.71,28.77 | v27.13,27.4 26.06,26.33 20.42,26.33 U3.8
PWM_LED2  (via drill 0.25 pad 0.15)
  Top 0.254: U4.20 72.05,17.64 72.85,16.84 v72.85,13.03
  Bottom 0.254: v72.85,13.03 72.85,8.59 70.31,6.04 41.08,6.04 39.05,8.08 39.05,19.44 38.61,19.89 U3.15
SCL  (via drill 0.25 pad 0.51)
  Top 0.254: v42.1,15.12 39.88,17.35 U3.14 | v42.1,9.35 42.07,6.67 57.1,6.68 58.29,5.49 CN1.1
  Bottom 0.254: v42.1,15.12 v42.1,9.35
SDA  (via drill 0.25 pad 0.51)
  Top 0.254: v36.83,7.95 36.83,5.92 55.32,5.92 55.75,5.49 CN1.2
  Bottom 0.254: v36.83,7.95 U3.13
SHORT1  (via drill 0.25 pad 0.15)
  Top 0.254: U1.21 65.94,50.99 v66.4,50.99 | v44.16,38.11 v44.16,35.85
  Bottom 0.254: v66.4,50.99 68.29,50.99 68.61,50.69 68.61,42.81 63.91,38.11 48.63,38.11 | 48.63,38.11 48.58,38.11 | 48.63,38.11 v44.16,38.11 | v44.16,35.85 44.15,35.34 39.2,27.51 U3.18 36.78,27.46 R5.2
SHORT2  (via drill 0.25 pad 0.15)
  Top 0.254: U4.21 v69.1,18.29 v69.1,18.3
  Bottom 0.254: v69.1,18.3 69.1,9.28 67.77,7.95 42.04,7.95 41.15,8.84 41.15,22.68 38.86,24.97 U3.17 R14.1
VDD  (via drill 0.25, 0.25 pad 0.15)
  Top 0.254: U4.6 54.8,19.59 53.88,20.52 53,20.52 52.65,20.17 R10.1 | U1.6 53.34,52.3 52.84,52.8 52.15,52.8 51.87,52.52 R1.1
  other vias: 4.83,37.35 6.99,37.35 9.14,37.35 5.46,31.83 4.51,31.83 3.56,31.83 3.05,27.7 3.94,27.7 3.05,27 3.81,38.87 4.32,40.4 9.14,38.87 9.14,40.4 21.84,56.36 14.73,57.88 14.73,56.87 15.75,56.87 15.24,56.36 15.24,57.37 16.26,56.36 19.3,54.83 20.32,54.83 20.83,55.85 21.84,58.9 20.83,58.9 21.34,57.88 16.26,58.9 17.27,58.9 18.29,58.9 17.27,57.88 18.29,57.88
  pour Bottom (no thermals): 10.73,41.1 10.79,37.03 6.22,29.98 6.22,26.17 5.08,26.24 2.54,26.24 2.35,39.57 2.35,40.91 2.29,41.1
  pour Top (no thermals): 51.02,51.7 57.88,51.7 57.88,51.57 56.1,51.57 55.21,50.69 52.93,50.69 52.67,50.43 52.67,48.86 51.07,48.88
  pour Top (no thermals): 40.64,50.59 39.94,49.89 39.94,18.81 40.89,17.86 51.83,17.86 51.83,16.66 53.61,16.66 53.61,17.79 55.32,17.79 56.2,18.87 58.88,18.87 58.88,19 53.47,19 53.48,20.04 51.56,19.99 51.5,20.87 44.3,20.87 43.1,22.37 43.1,50.07 42.69,50.59
  pour Top (no thermals): 8.26,41.27 13.3,49.15 13.3,57.07 15.2,59.87 35.8,59.87 37.1,57.97 41.5,57.97 41.5,52.97 50.9,52.97 50.92,52.16 52.57,52.16 52.57,49.92 46.84,49.94 46.81,48.85 33.02,48.84 18.03,48.84 6.48,30.37 6.35,26.17 2.54,26.17 2.54,41.27
  pour Bottom (no thermals): 12.19,55.34 12.7,55.34 13.21,54.83 13.72,54.33 15.75,54.33 15.75,54.32 16.2,53.87 20.6,53.87 23,56.27 23,59.37 22.5,59.87 14.2,59.87 14.18,59.87 12.19,57.88 12.19,57.18 12.2,57.17 14,57.17 14.1,57.07 14.1,55.57 14,55.47 12.2,55.47 12.2,55.35

### Text on the board
tPlace: Spectron LED Board / rev 1.5 - 2018
bPlace: Spectron LED Board / rev 1.5 / 2018
tNames: GND | +12V | LED Fan | - | PWM | - | + | + | LED 1 | +12V | LED 2 | + | - | Thermocouples (1-wire) | Temperature Sensors | DATA | GND | +3.3V | +3.3V | GND | SDA | SCL